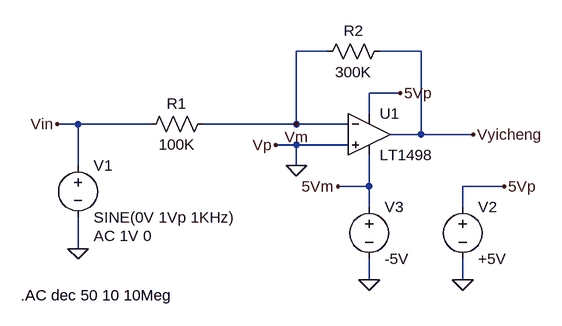
[diagram p0: schematic Draft1.asc]
Draft1.asc, the LTspice schematic file:
Version 4
SHEET 1 880 680
WIRE 448 -80 400 -80
WIRE 592 -80 528 -80
WIRE 560 -16 512 -16
WIRE 512 16 512 -16
WIRE 64 32 32 32
WIRE 176 32 64 32
WIRE 400 32 400 -80
WIRE 400 32 256 32
WIRE 480 32 400 32
WIRE 592 48 592 -80
WIRE 592 48 544 48
WIRE 672 48 592 48
WIRE 400 64 368 64
WIRE 480 64 400 64
WIRE 64 96 64 32
WIRE 400 96 400 64
WIRE 512 128 512 80
WIRE 512 128 464 128
WIRE 720 128 656 128
WIRE 512 160 512 128
WIRE 656 160 656 128
WIRE 64 224 64 176
WIRE 512 272 512 240
WIRE 656 272 656 240
FLAG 64 224 0
FLAG 400 96 0
FLAG 512 272 0
FLAG 656 272 0
FLAG 400 32 Vm
FLAG 368 64 Vp
FLAG 464 128 5Vm
FLAG 720 128 5Vp
FLAG 672 48 Vyicheng
FLAG 560 -16 5Vp
FLAG 32 32 Vin
SYMBOL voltage 64 80 R0
WINDOW 123 24 124 Left 2
WINDOW 39 0 0 Left 0
SYMATTR Value2 AC 1V 0
SYMATTR InstName V1
SYMATTR Value SINE(0V 1Vp 1KHz)
SYMBOL res 272 16 R90
WINDOW 0 0 56 VBottom 2
WINDOW 3 32 56 VTop 2
SYMATTR InstName R1
SYMATTR Value 100K
SYMBOL res 544 -96 R90
WINDOW 0 0 56 VBottom 2
WINDOW 3 32 56 VTop 2
SYMATTR InstName R2
SYMATTR Value 300K
SYMBOL OpAmps\\LT1498 512 -16 R0
SYMATTR InstName U1
SYMBOL voltage 656 144 R0
WINDOW 123 0 0 Left 0
WINDOW 39 0 0 Left 0
SYMATTR InstName V2
SYMATTR Value +5V
SYMBOL voltage 512 144 R0
WINDOW 123 0 0 Left 0
WINDOW 39 0 0 Left 0
SYMATTR InstName V3
SYMATTR Value -5V
TEXT -24 296 Left 2 !.AC dec 50 10 10Meg

The netlist it stands for:
* Draft1.asc
V1 Vin 0 SINE(0V 1Vp 1KHz) AC 1V 0
R1 Vm Vin 100K
R2 Vyicheng Vm 300K
XU1 0 Vm 5Vp 5Vm Vyicheng LT1498  ; pins In+ In- V+ V- OUT
V2 5Vp 0 +5V
V3 5Vm 0 -5V
.AC dec 50 10 10Meg
.lib LTC.lib
.backanno
.end